# Altium schematic sheet lcd.SchDoc
size A4
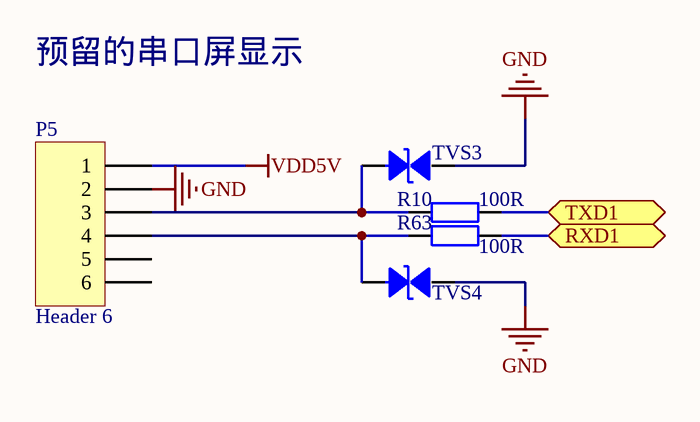
[diagram p0: lcd.SchDoc]

## Parts
P5  Header 6  [6X2MMZ]
R10  100R  [0603R]
R63  100R  [0603R]
TVS3  ESD5Z5.0CT1G  [SOD-523]  (value not drawn)
TVS4  ESD5Z5.0CT1G  [SOD-523]  (value not drawn)

## Ports
RXD1 (bidir), TXD1 (bidir)

## Nets
GND: P5.2 TVS3.1(A) TVS4.1(A)
VDD5V: P5.1
RXD1: R63.2 ; port RXD1
TXD1: R10.2 ; port TXD1
NetP5_3: P5.3 R10.1 TVS3.2(B)
NetP5_4: P5.4 R63.1 TVS4.2(B)

Not connected (* = marked no-connect by the designer): P5 5 6

## Notes on the sheet
- 预留的串口屏显示

## Library data of the parts
P5 = Header 6: Header, 6-Pin; LatestRevisionDate: 17-Jul-2002; LatestRevisionNote: Re-released for DXP Platform.; Publisher: Altium Limited
R10 R63 = RES2: 贴片电阻 5%
TVS3 TVS4 = TVS-1: TVS